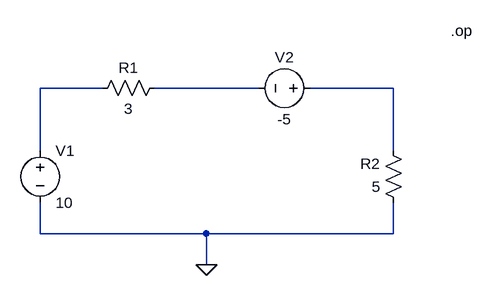
[diagram p0: schematic guia_1A_ej_3.asc]
guia_1A_ej_3.asc, the LTspice schematic file:
Version 4
SHEET 1 880 680
WIRE 176 256 80 256
WIRE 416 256 256 256
WIRE 624 256 496 256
WIRE 80 352 80 256
WIRE 624 352 624 256
WIRE 80 480 80 432
WIRE 336 480 80 480
WIRE 624 480 624 432
WIRE 624 480 336 480
WIRE 336 528 336 480
FLAG 336 528 0
SYMBOL voltage 80 336 R0
SYMATTR InstName V1
SYMATTR Value 10
SYMBOL voltage 512 256 R90
WINDOW 0 -32 56 VBottom 2
WINDOW 3 32 56 VTop 2
SYMATTR InstName V2
SYMATTR Value -5
SYMBOL res 272 240 R90
WINDOW 0 0 56 VBottom 2
WINDOW 3 32 56 VTop 2
SYMATTR InstName R1
SYMATTR Value 3
SYMBOL res 640 448 R180
WINDOW 0 36 76 Left 2
WINDOW 3 36 40 Left 2
SYMATTR InstName R2
SYMATTR Value 5
TEXT 712 168 Left 2 !.op

The netlist it stands for:
* guia_1A_ej_3.asc
V1 N001 0 10
V2 N003 N002 -5
R1 N002 N001 3
R2 0 N003 5
.op
.backanno
.end